# EAGLE schematic Sensor_Pressure_MS5611-01BA03_I2C_0b1110110 (EAGLE 6.5.0)
Barometric Pressure Sensor: MS5611-01BA03 Datasheet <http://www.meas-spec.com/downloads/MS5611-01BA03.pdf>
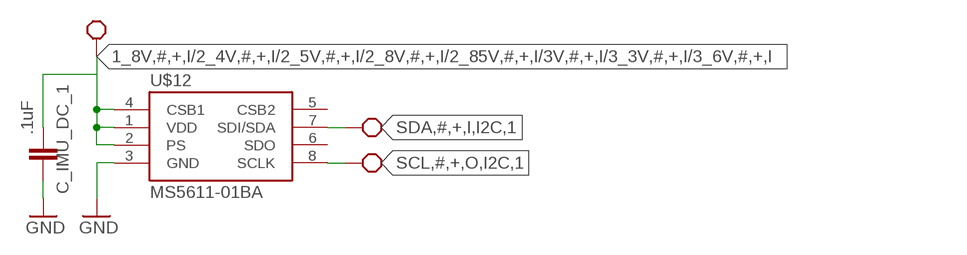
[diagram p0: schematic, sheet 1]

## Parts
C_IMU_DC_1  .1uF  CAP0402-CAP  [0402-CAP]
U$12  MS5611-01BA  [MS5611-01BA]

## Nets
1_8V,#,+,I/2_4V,#,+,I/2_5V,#,+,I/2_8V,#,+,I/2_85V,#,+,I/3V,#,+,I/3_3V,#,+,I/3_6V,#,+,I: C_IMU_DC_1.2 U$12.1(VDD) U$12.2(PS) U$12.4(CSB1) ; supply symbol labelled BLOCK_REQUIREMENT
GND: C_IMU_DC_1.1 U$12.3(GND)
SCL,#,+,O,I2C,1: U$12.8(SCLK) ; supply symbol labelled BLOCK_REQUIREMENT
SDA,#,+,I,I2C,1: U$12.7(SDI/SDA) ; supply symbol labelled BLOCK_REQUIREMENT
Unconnected: U$12.5(CSB2) U$12.6(SDO)

## Library data of the parts
C_IMU_DC_1 = SparkFun:CAP: Capacitor Standard 0603 ceramic capacitor, and 0.1" leaded capacitor.
U$12 = 3DRobotics:MS5611-01BA: MS5611-01BA The MS5611-01BA is a new generation of high resolution altimeter sensors from MEAS Switzerland with SPI and I 2 C bus interface. It is optimized for altimeters and variometers with an altitude resolution of 10 cm. The sensor module includes a high linearity pressure sensor and an ultra low power 24 bit ?? ADC with internal factory calibrated coefficients. It provides a precise digital 24 Bit pressure and temperature value and different operation modes that allow the user to optimize for conversion speed and current consumption. A high resolution temperature output allows the implementation of an altimeter/thermometer function without any additional sensor. The MS5611-01BA can be interfaced to virtually any microcontroller. The communication protocol is simple, without the need of programming internal registers in the device. Small dimensions of only 5.0 mm x 3.0 mm and a height of 1.7 mm allow for integration in mobile devices. This new sensor module generation is based on leading MEMS technology and latest benefits from MEAS Switzerland proven experience and know-how in high volume manufacturing of altimeter modules, which have been widely used for over a decade. The sensing principle employed leads to very low hysteresis and high stability of both pressure and temperature signal. High resolution module, 10 cm Fast conversion down to 1 ms Low power, 1 µA (standby < 0.15 µA) QFN package 5.0 x 3.0 x 1.7 mm3 Supply voltage 1.8 to 3.6 V Integrated digital pressure sensor (24 bit ?? ADC) Operating range: 10 to 1200 mbar, -40 to +85 °C I2C and SPI interface up to 20 MHz No external components (Internal oscillator) Excellent long term stability; DATASHEET: http://www.meas-spec.com/downloads/MS5611-01BA01.pdf; LINK: http://www.meas-spec.com/product/t_product.aspx?id=8503#; MFGPN: MS5611-01BA

## Net classes
0 default: width 0.178 mm, drill 0.381 mm, clearance 0.178 mm